# EAGLE design lmr14206 (EAGLE 7.7.0)
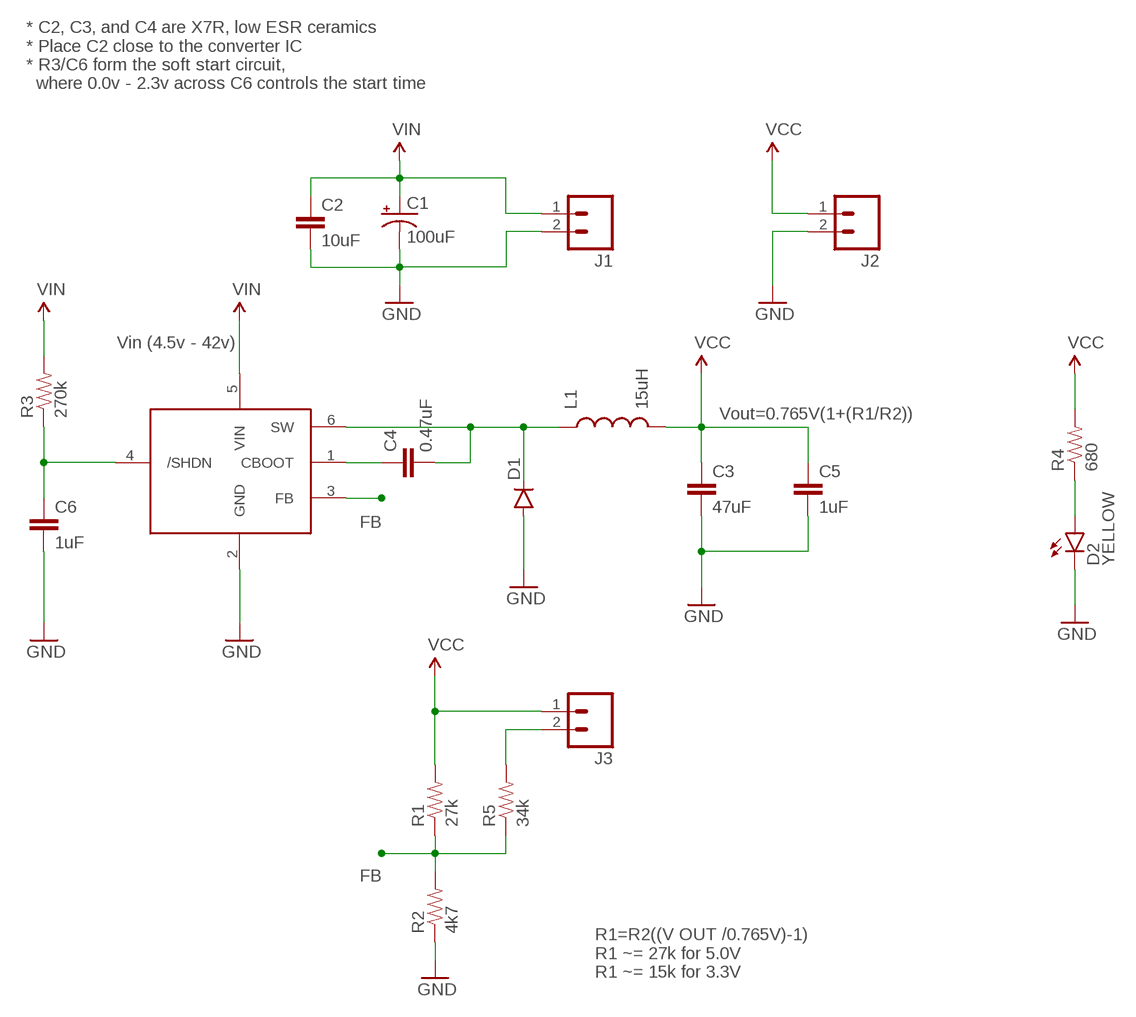
[diagram p0: schematic, sheet 1]

## Parts
C1  100uF  CAP_POLC  [PANASONIC_C]
C2  10uF  1UF-25V-10%(0805)"  [0805-CAP]
C3  47uF  100UF6.3V20%(1210)  [1210]
C4  0.47uF  1UF-25V-10%(0805)"  [0805-CAP]
C5  1uF  1UF-25V-10%(0805)"  [0805-CAP]
C6  1uF  1UF-25V-10%(0805)"  [0805-CAP]
D1  DIODESMB  [SMB-DIODE]
D2  YELLOW  LED-YELLOW1206  [LED-1206]
J1  M02JST-PTH-VERT  [JST-2-PTH-VERT]
J2  M02PTH  [1X02]
J3  M02PTH  [1X02]
L1  15uH  INDUCTOR1206H*  [INDUCTOR-1206]
R1  27k  0.75OHM-1/4W-1%(0805)  [0805]
R2  4k7  0.75OHM-1/4W-1%(0805)  [0805]
R3  270k  0.75OHM-1/4W-1%(0805)  [0805]
R4  680  0.3OHM-1/8W-1%(0805)  [0805]
R5  34k  0.75OHM-1/4W-1%(0805)  [0805]
U$1  LMR14206TSOT-6  [TSOT-6]

## Nets
FB: R1.1 R2.2 R5.1 U$1.3(FB)
GND: C1.- C2.2 C3.2 C5.2 C6.2 D1.A D2.C J1.2 J2.2 R2.1 U$1.2(GND)
N$1: J3.2 R5.2
N$2: D2.A R4.1
N$3: C4.1 U$1.1(CBOOT)
N$4: C4.2 D1.C L1.P$1 U$1.6(SW)
N$5: C6.1 R3.1 U$1.4(/SHDN)
VCC: C3.1 C5.1 J2.1 J3.1 L1.P$2 R1.2 R4.2
VIN: C1.+ C2.1 J1.1 R3.2 U$1.5(VIN)

## Notes on the sheet
- * C2, C3, and C4 are X7R, low ESR ceramics
  * Place C2 close to the converter IC
  * R3/C6 form the soft start circuit,
    where 0.0v - 2.3v across C6 controls the start time
- Vin (4.5v - 42v)
- Vout=0.765V(1+(R1/R2))
- R1=R2((V OUT /0.765V)-1)
  R1 ~= 27k for 5.0V
  R1 ~= 15k for 3.3V

## Library data of the parts
C1 = SparkFun-Capacitors:CAP_POL: Capacitor Polarized These are standard SMD and PTH capacitors. Normally 10uF, 47uF, and 100uF in electrolytic and tantalum varieties. Always verify the external diameter of the through hole cap, it varies with capacity, voltage, and manufacturer. The EIA devices should be standard.
C2 C4-C6 = SparkFun-Capacitors:1UF-25V-10%(0805): CAP-08064
C3 = SparkFun-Capacitors:100UF6.3V20%(1210): CAP-09827; PROD_ID: CAP-09827; VALUE: 100uF
D1 = SparkFun-DiscreteSemi:DIODE: Diode These are standard reverse protection diodes and small signal diodes. SMA package can handle up to about 1A. SOD-323 can handle about 200mA. What the SOD-323 package when ordering, there are some mfgs out there that are 5-pin packages.; PROD_ID: DIO-09646
D2 = SparkFun-LED:LED-YELLOW: Yellow SMD LEDs LilyPad 1206- DIO-09909 0603- DIO-09003 "SMART" means more efficient and expensive; PROD_ID: DIO-00820
J1-J3 = SparkFun-Connectors:M02: Standard 2-pin 0.1" header. Use with - straight break away headers ( PRT-00116) - right angle break away headers (PRT-00553) - swiss pins (PRT-00743) - machine pins (PRT-00117) - female headers (PRT-00115) Molex polarized connector foot print use with: PRT-08233 with associated crimp pins and housings. 2.54_SCREWTERM for use with PRT-10571. 3.5mm Screw Terminal footprints for PRT-08084 5mm Screw Terminal footprints for use with PRT-08432
L1 = SparkFun-Passives:INDUCTOR: Inductors Basic Inductor/Choke - 0603 and 1206. Footprints are not proven and vary greatly between part numbers. INDUCTOR POWER 3.3UH 4.0A SMD 0.197" L x 0.197" W x 0.177" H (5.00mm x 5.00mm x 4.50mm)
R1-R3 R5 = SparkFun-Resistors:0.75OHM-1/4W-1%(0805): RES-08474; PROD_ID: RES-08474; VALUE: 0.75
R4 = SparkFun-Resistors:0.3OHM-1/8W-1%(0805): RES-11622; PROD_ID: RES-11622; VALUE: 0.3
U$1 = Synapseware:LMR14206

## Board
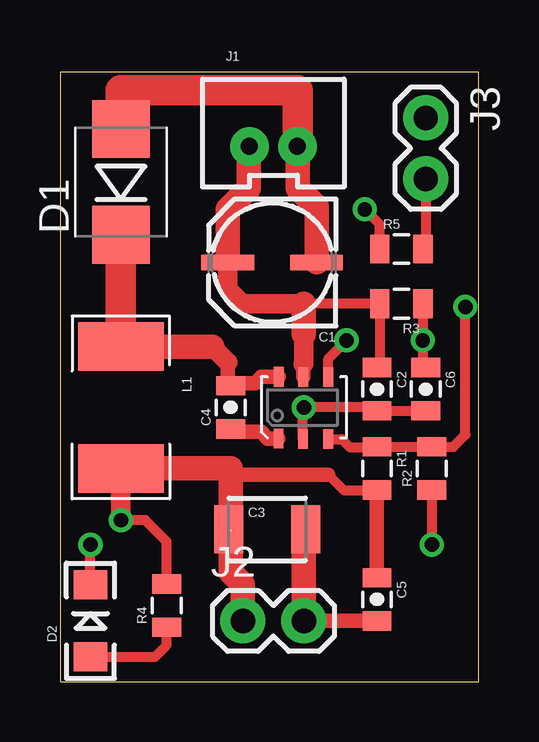
[diagram p1: board, top side]
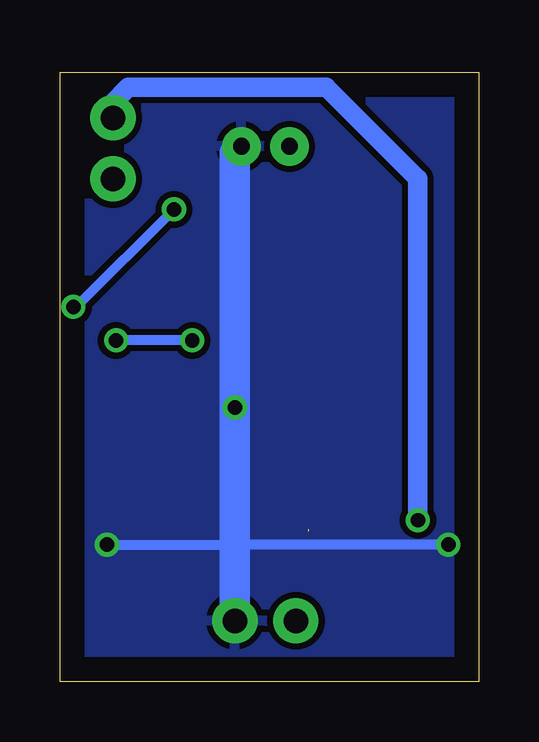
[diagram p2: board, bottom side, seen from below]

Size 17.45 x 25.39 mm. Coordinates in mm from the lower left corner, seen from the top.
Outline: 0,0 17.45,0 17.45,25.39 0,25.39 0,0
Copper layers (1*16): Top 0.035mm / dielectric 1.5mm / Bottom 0.035mm
Design rules "default": minimum track width 10mil, minimum drill 24mil, track to track 8mil, track to pad 8mil, pad to pad 8mil, via to via 8mil, smd to smd 8mil, copper to edge 40mil, drill to drill 8mil, minimum pad ring 10mil, minimum via ring 8mil, stop-mask expansion 4mil, vias tented up to drill 0mil, thermal gap 10mil

### Footprints (pad centres in the part's own frame; a part is rotated, then mirrored left to right if it is on the bottom)
PANASONIC_C = smd 2.2 x 0.65: + 1.9,-0.2; - -1.8,-0.2
0805-CAP = smd 0.8 x 1.2: 1 -0.9,0; 2 0.9,0
1210 = smd 1.2 x 2: 1 -1.6,0; 2 1.6,0
SMB-DIODE = smd 2.4 x 2.4: A 2.2,0; C -2.2,0
LED-1206 = smd 1.2 x 1.4: A -1.5,0; C 1.5,0
JST-2-PTH-VERT = drill 0.7 pad 1.6: 1 -1,-0.55; 2 1,-0.55
1X02 = drill 1.016 pad 1.88: 1 0,0; 2 2.54,0
INDUCTOR-1206 = smd 2.032 x 3.556: P$1 -2.54,0; P$2 2.54,0
0805 = smd 0.8 x 1.2: 1 -0.9,0; 2 0.9,0
TSOT-6 = smd 0.406 x 0.813: 1 -1.06,-1.3; 2 -0.04,-1.32; 3 1.02,-1.32; 4 1.02,1.27; 5 -0.02,1.27; 6 -1.05,1.28

### Placement (x,y rotation side)
C1  8.89,17.27 180 top
C2  13.21,12.19 270 top
C3  8.64,6.35 0 top
C4  7.11,11.43 90 top
C5  13.21,3.43 270 top
C6  15.24,12.19 270 top
D1  2.54,20.83 90 top
D2  1.27,2.54 90 top
J1  8.89,22.86 0 top
J2  7.62,2.54 0 top
J3  15.24,23.5 270 top
L1  2.54,11.43 270 top
R1  13.21,8.89 270 top
R2  15.49,8.89 90 top
R3  14.22,15.75 180 top
R4  4.45,3.17 90 top
R5  14.22,18.03 0 top
U$1  10.16,11.43 0 top

### Tracks (layer width: path | path; a pad name or v marks a point on that pad's centre or on a via)
FB  (via drill 0.6)
  Top 0.406: U$1.3 11.73,10.11 12.06,9.78 13.2,9.78 R1.1 R2.2 16.39,9.79 16.89,10.29 v16.89,15.62 | R5.1 13.32,19.06 v12.7,19.68
  Bottom 0.406: v16.89,15.62 16.76,15.62 v12.7,19.68
GND  (via drill 0.6)
  Top 0.406: C6.2 C2.2 13.07,11.43 v10.16,11.43 10.12,11.39 U$1.2 | D2.C v1.27,5.71 | R2.1 v15.49,5.71
  Top 0.61: J2.2 13.2,2.54 C5.2
  Top 1.016: C1.- 10.69,19.79 9.91,20.57 9.91,22.29 J1.2 | C3.2 10.24,6.02 10.16,5.84 J2.2
  Top 1.27: D1.A 2.54,24.64 9.91,24.64 9.91,22.58 J1.2
  Bottom 0.406: 10.16,6.99 10.24,6.91 10.24,5.71 v15.49,5.71 | v1.27,5.71 10.16,5.71
  Bottom 1.27: J2.2 10.16,5.71 10.16,6.99 v10.16,11.43 10.16,22.04 J1.2
  pour Bottom (isolate 0.254): 0,0 17.14,0 17.14,25.4 0,25.4
N$1
  Top 0.406: J3.2 15.24,18.15 R5.2
N$2
  Top 0.406: D2.A 3.96,1.04 4.45,1.52 R4.1
N$3
  Top 0.61: U$1.1 8.67,10.13 8.38,10.41 7.23,10.41 C4.1
N$4
  Top 0.61: U$1.6 8.39,12.71 8.13,12.45 7.23,12.45 C4.2 7,12.45 7,13.32
  Top 0.813: 7,13.32 6.35,13.97
  Top 1.016: 6.35,13.97 L1.P$1
  Top 1.27: D1.C L1.P$1
N$5  (via drill 0.6)
  Top 0.406: U$1.4 11.18,13.47 v11.94,14.22 | 15.36,13.21 C6.1 15.12,13.21 15.12,14.22 | R3.1 15.12,14.22 | v15.11,14.22 15.12,14.22
  Bottom 0.406: v11.94,14.22 v15.11,14.22
VCC  (via drill 0.6)  (1 unrouted)
  Top 0.406: 11.18,8.64 11.82,7.99 R1.2 | R4.2 4.45,5.84 3.56,6.73 v2.54,6.73
  Top 0.61: 11.18,8.64 7.11,8.64 | C5.1 R1.2
  Top 0.813: v2.54,6.73 L1.P$2
  Top 1.016: C3.1 7.11,6.35 7.11,8.64 7.11,8.89 L1.P$2 | J2.1 7.62,4.06 7.11,4.57 7.11,6.27
  Bottom 0.813: J3.1 15.24,24.13 14.61,24.77 6.35,24.77 2.54,20.95 v2.54,6.73 2.54,10.67
VIN
  Top 0.406: 10.16,15.75 R3.2 13.32,13.21 C2.1
  Top 0.61: U$1.5 10.14,13.23
  Top 0.813: C1.+ 6.99,16.38 7.62,15.75 10.16,15.75 | 10.16,14.48 10.16,13.25 10.14,13.23
  Top 1.016: C1.+ 6.99,19.69 7.87,20.57 7.87,22.29 J1.1 | 10.16,15.75 10.16,14.48